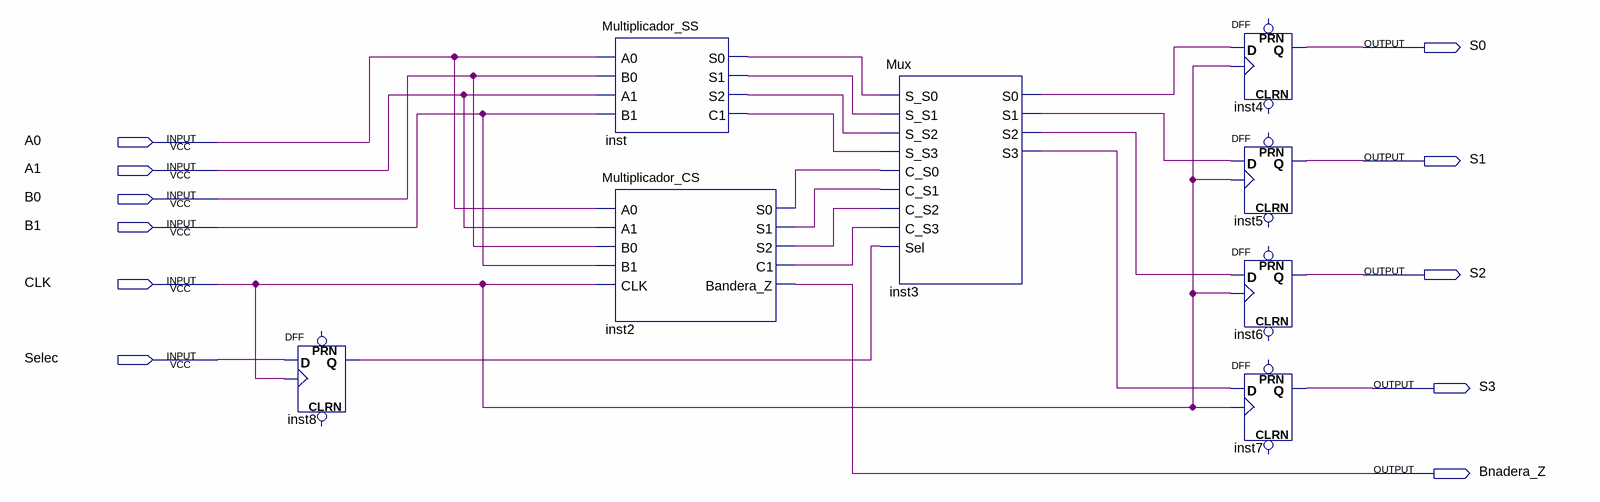
[diagram p0: schematic sheet]
// Quartus schematic Parte_D.bdf as structural Verilog: 8 symbols, 11 pins
module Parte_D (
  input  A0,
  input  A1,
  input  B0,
  input  B1,
  input  CLK,
  input  Selec,
  output S0,
  output S1,
  output S2,
  output S3,
  output Bnadera_Z
);

  wire inst2_c1, inst2_s0, inst2_s1, inst2_s2, inst3_s0, inst3_s1, inst3_s2, inst3_s3, inst8_q, inst_c1,
       inst_s0, inst_s1, inst_s2;

  DFF inst8 (.CLK(CLK), .D(Selec), .Q(inst8_q));  // open: CLRN, PRN
  Multiplicador_SS inst (.A0(A0), .B0(B0), .A1(A1), .B1(B1), .S0(inst_s0), .S1(inst_s1), .S2(inst_s2), .C1(inst_c1));
  Multiplicador_CS inst2 (
    .A0(A0), .A1(A1), .B0(B0), .B1(B1), .CLK(CLK), .S0(inst2_s0), .S1(inst2_s1), .S2(inst2_s2),
    .C1(inst2_c1), .Bandera_Z(Bnadera_Z));
  Mux inst3 (
    .S_S0(inst_s0), .S_S1(inst_s1), .S_S2(inst_s2), .S_S3(inst_c1), .C_S0(inst2_s0), .C_S1(inst2_s1),
    .C_S2(inst2_s2), .C_S3(inst2_c1), .Sel(inst8_q), .S0(inst3_s0), .S1(inst3_s1), .S2(inst3_s2),
    .S3(inst3_s3));
  DFF inst4 (.CLK(CLK), .D(inst3_s0), .Q(S0));  // open: CLRN, PRN
  DFF inst5 (.CLK(CLK), .D(inst3_s1), .Q(S1));  // open: CLRN, PRN
  DFF inst6 (.CLK(CLK), .D(inst3_s2), .Q(S2));  // open: CLRN, PRN
  DFF inst7 (.CLK(CLK), .D(inst3_s3), .Q(S3));  // open: CLRN, PRN
endmodule
